# EAGLE design rfid_part (EAGLE 8.0.1)
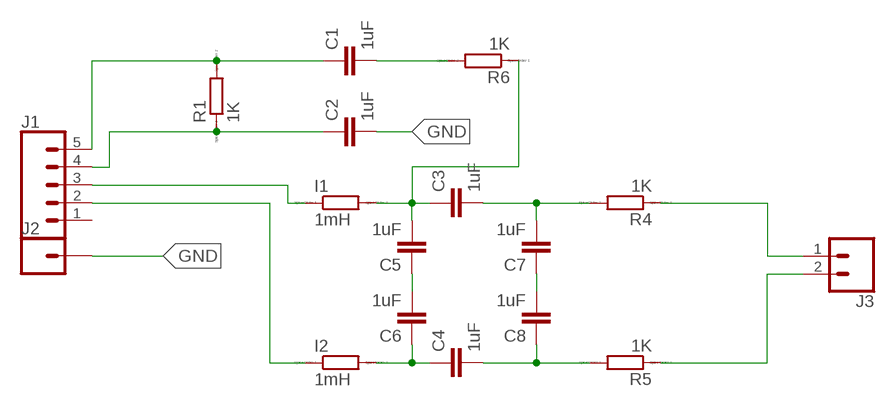
[diagram p0: schematic, sheet 1]

## Parts
C1  1uF  C-EUC0603  [C0603]
C2  1uF  C-EUC0603  [C0603]
C3  1uF  C-EUC0603  [C0603]
C4  1uF  C-EUC0603  [C0603]
C5  1uF  C-EUC0603  [C0603]
C6  1uF  C-EUC0603  [C0603]
C7  1uF  C-EUC0603  [C0603]
C8  1uF  C-EUC0603  [C0603]
I1  1mH  RR0603  [R0603]
I2  1mH  RR0603  [R0603]
J1  CONN_05  [1X05]
J2  CONN_01  [1X01]
J3  CONN_02  [1X02]
R1  1K  RR0603  [R0603]
R4  1K  RR0603  [R0603]
R5  1K  RR0603  [R0603]
R6  1K  RR0603  [R0603]

## Nets
GND: C2.2 J2.1
N$1: C1.1 J1.5 R1.2
N$2: C2.1 J1.4 R1.1
N$3: I1.1 J1.3
N$4: I2.1 J1.2
N$5: C3.1 C5.2 I1.2 R6.1
N$6: C5.1 C6.2
N$7: C4.1 C6.1 I2.2
N$8: C3.2 C7.2 R4.2
N$9: C4.2 C8.1 R5.2
N$10: C7.1 C8.2
N$11: J3.1 R4.1
N$12: J3.2 R5.1
N$13: C1.2 R6.2
Unconnected: J1.1

## Library data of the parts
C1-C8 = resistor:C-EU: CAPACITOR, European symbol
I1 I2 R1 R4-R6 = eagle-ltspice:R: RESISTOR, European symbol; SPICEMODEL: NONE; SPICEPREFIX: R
J1 = SparkFun-Connectors:CONN_05: Multi connection point. Often used as Generic Header-pin footprint for 0.1 inch spaced/style header connections On any of the 0.1 inch spaced packages, you can populate with these: Break Away Headers - Straight <https://www.sparkfun.com/products/116> (PRT-00116) Break Away Male Headers - Right Angle <https://www.sparkfun.com/products/553> (PRT-00553) Female Headers <https://www.sparkfun.com/products/115> (PRT-00115) Break Away Headers - Machine Pin <https://www.sparkfun.com/products/117> (PRT-00117) Break Away Female Headers - Swiss Machine Pin <https://www.sparkfun.com/products/743> (PRT-00743) For SCREWTERMINALS and SPRING TERMINALS visit here: Screw Terimnals on SparkFun.com <https://www.sparkfun.com/search/results?term=Screw+Terminals> (5mm/3.5mm/2.54mm spacing) This device is also useful as a general connection point to wire up your design to another part of your project. Our various solder wires solder well into these plated through hole pads. Hook-Up Wire - Assortment (Stranded, 22 AWG) <https://www.sparkfun.com/products/11375> (PRT-11375) Hook-Up Wire - Assortment (Solid Core, 22 AWG) <https://www.sparkfun.com/products/11367> (PRT-11367) View the entire wire category on our website here <https://www.sparkfun.com/categories/141> Special notes: Molex polarized connector foot print use with SKU : PRT-08231 with associated crimp pins and housings. 1MM SMD Version SKU: PRT-10208
J2 = SparkFun-Connectors:CONN_01: Single connection point. Often used as Generic Header-pin footprint for 0.1 inch spaced/style header connections On any of the 0.1 inch spaced packages, you can populate with these: Break Away Headers - Straight <https://www.sparkfun.com/products/116> (PRT-00116) Break Away Male Headers - Right Angle <https://www.sparkfun.com/products/553> (PRT-00553) Female Headers <https://www.sparkfun.com/products/115> (PRT-00115) Break Away Headers - Machine Pin <https://www.sparkfun.com/products/117> (PRT-00117) Break Away Female Headers - Swiss Machine Pin <https://www.sparkfun.com/products/743> (PRT-00743) This device is also useful as a general connection point to wire up your design to another part of your project. Our various solder wires solder well into these plated through hole pads. Hook-Up Wire - Assortment (Stranded, 22 AWG) <https://www.sparkfun.com/products/11375> (PRT-11375) Hook-Up Wire - Assortment (Solid Core, 22 AWG) <https://www.sparkfun.com/products/11367> (PRT-11367) View the entire wire category on our website here <https://www.sparkfun.com/categories/141> Special notes: SMTSO-256-ET is a "flush mount" nut for a 4-40 screw. We mostly use this on specialty testbeds; it is a nice way to connect hardware to your PCB at an adjustable hieght. Also note, the SNAP packages are for using a snappable style connector. We sell a baggie of snaps and they are also used on two LilyPad designs: Snap Assortment - 30 pack (male and female) <https://www.sparkfun.com/products/11347> (DEV-11347) LilyPad Arduino SimpleSnap <https://www.sparkfun.com/products/10941> (DEV-10941) LilyPad SimpleSnap Protoboard <https://www.sparkfun.com/products/10940> (DEV-10940)
J3 = SparkFun-Connectors:CONN_02: Multi connection point. Often used as Generic Header-pin footprint for 0.1 inch spaced/style header connections On any of the 0.1 inch spaced packages, you can populate with these: Break Away Headers - Straight <https://www.sparkfun.com/products/116> (PRT-00116) Break Away Male Headers - Right Angle <https://www.sparkfun.com/products/553> (PRT-00553) Female Headers <https://www.sparkfun.com/products/115> (PRT-00115) Break Away Headers - Machine Pin <https://www.sparkfun.com/products/117> (PRT-00117) Break Away Female Headers - Swiss Machine Pin <https://www.sparkfun.com/products/743> (PRT-00743) For SCREWTERMINALS and SPRING TERMINALS visit here: Screw Terimnals on SparkFun.com <https://www.sparkfun.com/search/results?term=Screw+Terminals> (5mm/3.5mm/2.54mm spacing) This device is also useful as a general connection point to wire up your design to another part of your project. Our various solder wires solder well into these plated through hole pads. Hook-Up Wire - Assortment (Stranded, 22 AWG) <https://www.sparkfun.com/products/11375> (PRT-11375) Hook-Up Wire - Assortment (Solid Core, 22 AWG) <https://www.sparkfun.com/products/11367> (PRT-11367) View the entire wire category on our website here <https://www.sparkfun.com/categories/141> Special notes: Molex polarized connector foot print use with: PRT-08233 with associated crimp pins and housings. 2.54_SCREWTERM for use with PRT-10571. 3.5mm Screw Terminal footprints for PRT-08084 5mm Screw Terminal footprints for use with PRT-08432

## Board
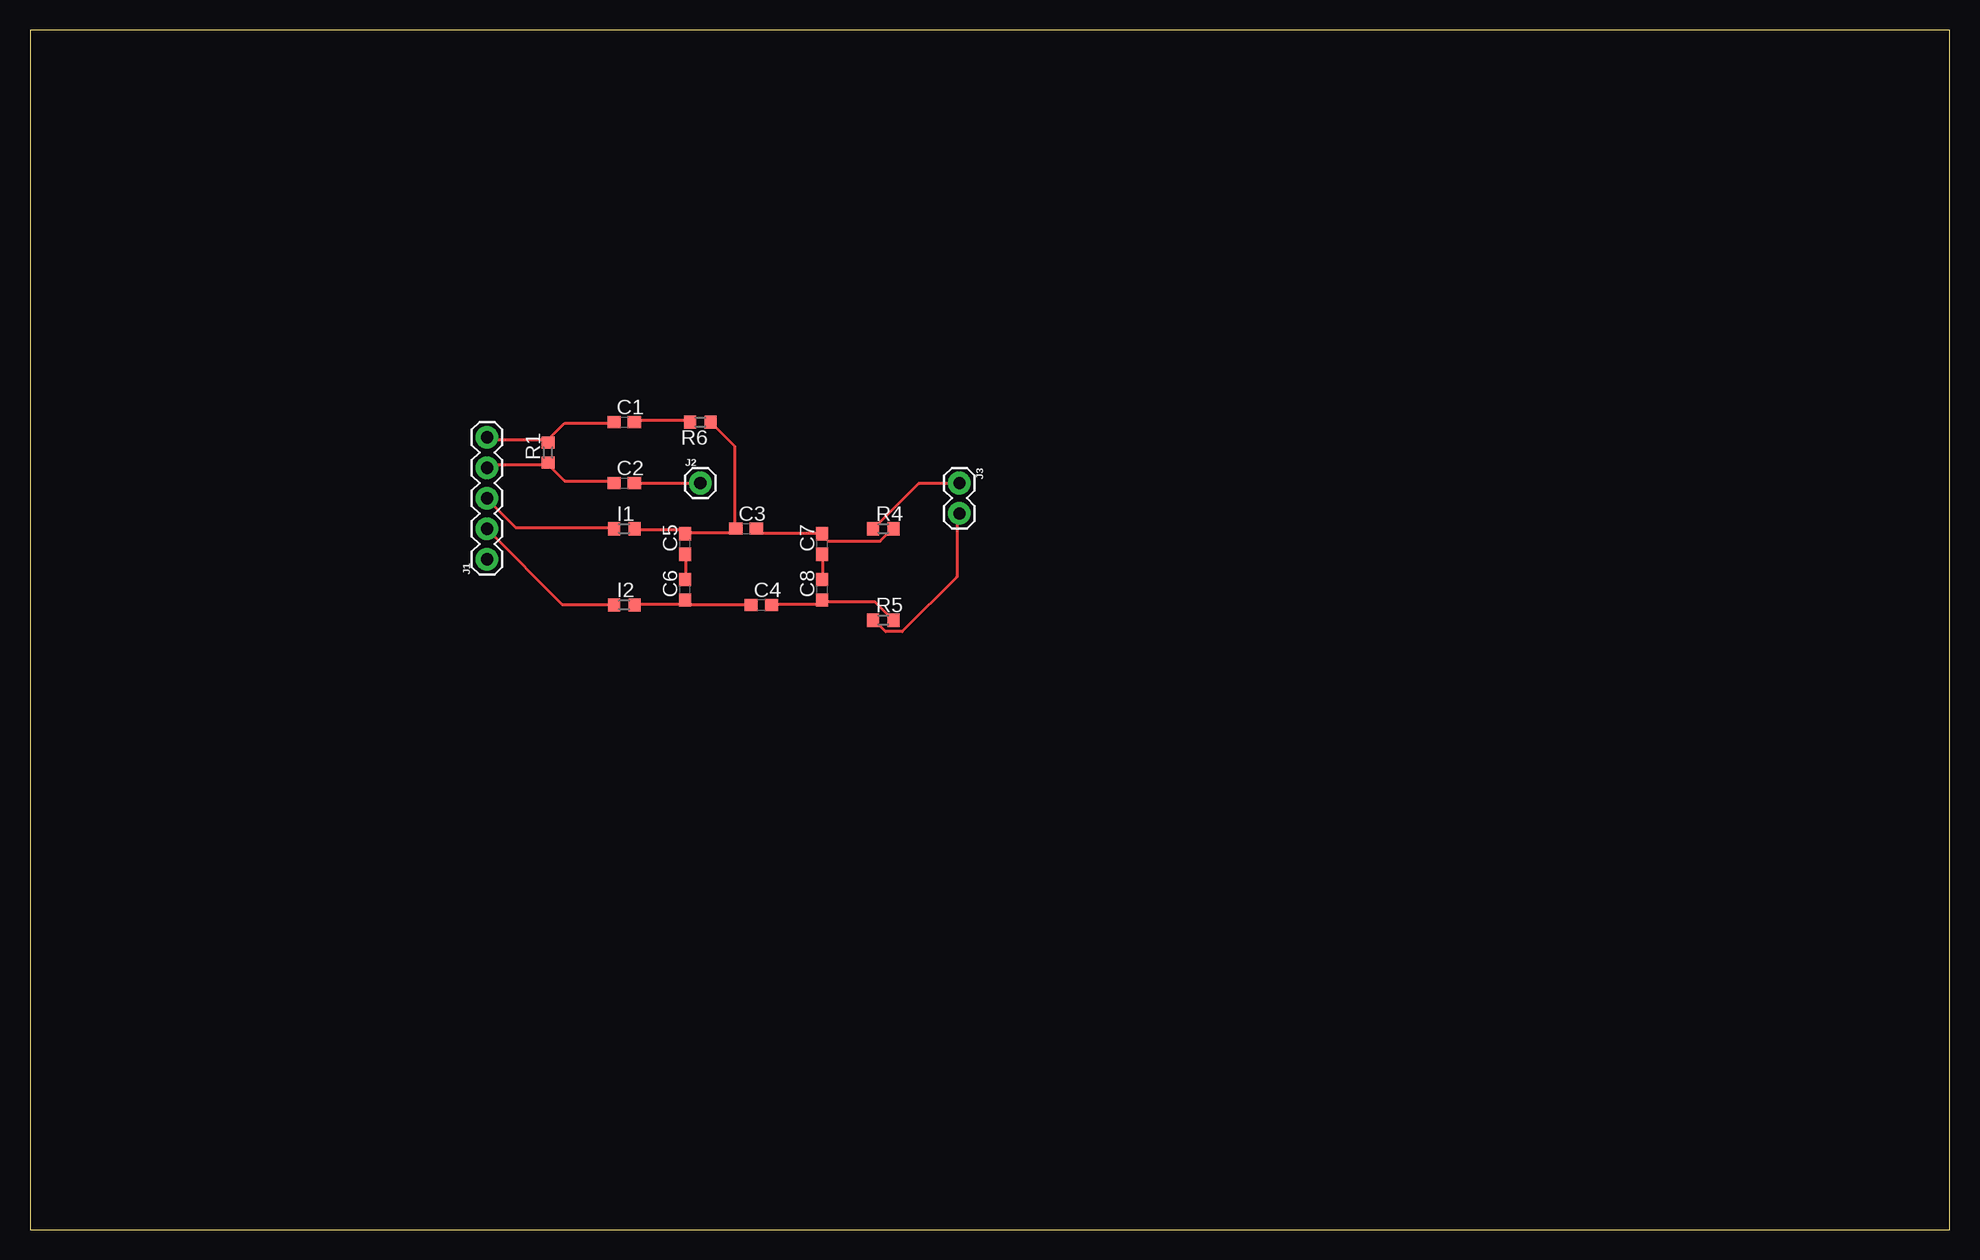
[diagram p1: board, top side]

Size 160 x 100 mm. Coordinates in mm from the lower left corner, seen from the top.
Outline: 0,0 160,0 160,100 0,100 0,0
Copper layers (1*16): Top 0.035mm / dielectric 1.5mm / Bottom 0.035mm
Design rules "default": minimum track width 10mil, minimum drill 24mil, track to track 8mil, track to pad 8mil, pad to pad 8mil, via to via 8mil, smd to smd 8mil, copper to edge 40mil, drill to drill 8mil, minimum pad ring 10mil, minimum via ring 8mil, stop-mask expansion 4mil, vias tented up to drill 0mil, thermal gap 10mil

### Footprints (pad centres in the part's own frame; a part is rotated, then mirrored left to right if it is on the bottom)
C0603 = smd 1.1 x 1: 1 -0.85,0; 2 0.85,0
R0603 = smd 1 x 1.1: 1 -0.85,0; 2 0.85,0
1X05 = drill 1.016 pad 1.88: 1 0,0; 2 2.54,0; 3 5.08,0; 4 7.62,0; 5 10.16,0
1X01 = drill 1.016 pad 1.88: 1 0,0
1X02 = drill 1.016 pad 1.88: 1 0,0; 2 2.54,0

### Placement (x,y rotation side)
C1  49.53,67.31 0 top
C2  49.53,62.23 0 top
C3  59.69,58.42 0 top
C4  60.96,52.07 0 top
C5  54.61,57.15 90 top
C6  54.61,53.34 90 top
C7  66.04,57.15 90 top
C8  66.04,53.34 90 top
I1  49.53,58.42 0 top
I2  49.53,52.07 0 top
J1  38.1,55.88 90 top
J2  55.88,62.23 0 top
J3  77.47,62.23 270 top
R1  43.18,64.77 90 top
R4  71.12,58.42 0 top
R5  71.12,50.8 0 top
R6  55.88,67.31 180 top

### Tracks (layer width: path | path; a pad name or v marks a point on that pad's centre or on a via)
GND
  Top 0.254: C2.2 50.52,62.18 55.78,62.18 J2.1
N$1
  Top 0.254: J1.5 38.18,65.84 42.98,65.84 R1.2 43.2,65.84 44.58,67.21 48.46,67.21 C1.1
N$2
  Top 0.254: J1.4 38.18,63.55 38.41,63.78 42.98,63.78 R1.1 43.2,63.78 44.58,62.41 48.46,62.41 C2.1
N$3
  Top 0.254: I1.1 48.46,58.52 40.46,58.52 38.18,60.81 J1.3
N$4
  Top 0.254: I2.1 48.46,52.12 44.35,52.12 38.18,58.29 J1.2
N$5
  Top 0.254: I1.2 50.52,58.29 54.18,58.29 54.41,58.06 C5.2 54.63,58.06 58.52,58.06 58.75,58.29 C3.1 58.75,58.52 58.75,65.29 R6.1 56.92,67.21
N$6
  Top 0.254: C6.2 54.63,54.41 54.63,56.24 C5.1
N$7
  Top 0.254: I2.2 50.52,52.12 54.18,52.12 54.41,52.35 C6.1 54.63,52.35 54.86,52.12 59.89,52.12 C4.1
N$8
  Top 0.254: C3.2 60.58,58.29 60.81,58.06 65.84,58.06 C7.2 66.06,57.84 66.52,57.38 70.87,57.38 71.78,58.29 R4.2
N$9
  Top 0.254: C4.2 61.95,52.12 65.61,52.12 65.84,52.35 C8.1 66.06,52.35 70.41,52.35 71.78,50.98 R5.2
N$10
  Top 0.254: C8.2 66.06,54.41 66.06,56.24 C7.1
N$11
  Top 0.254: R4.1 70.41,58.52 74.07,62.18 77.27,62.18 J3.1
N$12
  Top 0.254: R5.1 70.41,50.75 71.32,49.84 72.69,49.84 77.27,54.41 77.27,59.66 J3.2
N$13
  Top 0.254: C1.2 50.52,67.44 54.86,67.44 R6.2